# EAGLE design Drone (EAGLE 9.6.2)
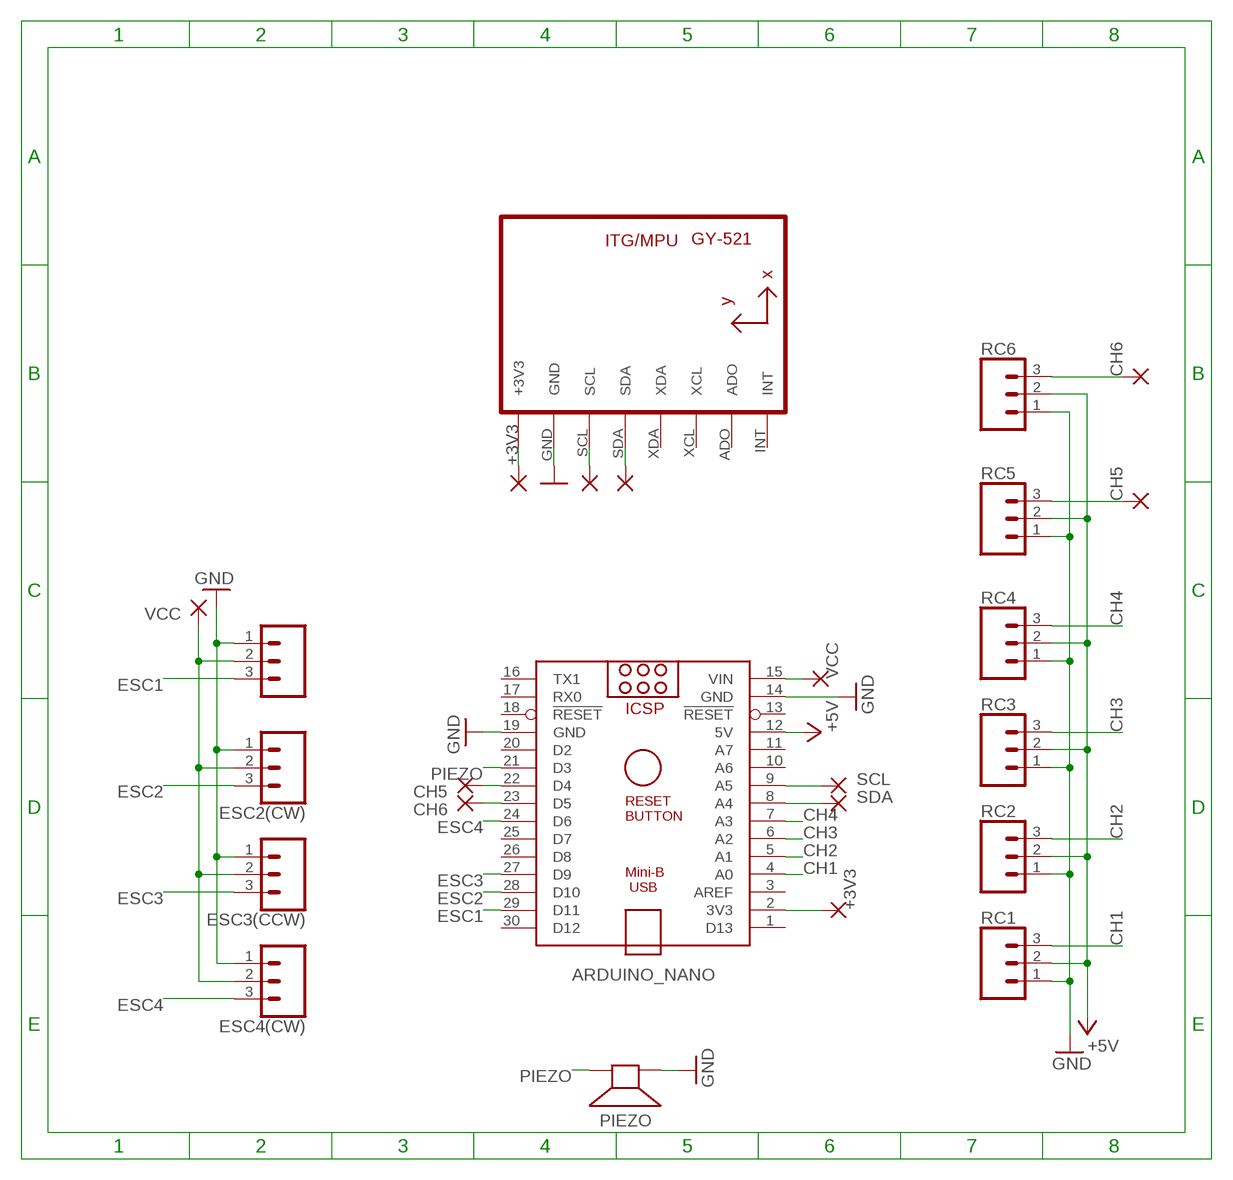
[diagram p0: schematic, sheet 1]

## Parts
+3V3-1  +3V3  WIREPAD1,6/0,8  [1,6/0,8]
+3V3-2  +3V3  WIREPAD1,6/0,8  [1,6/0,8]
ARDUINO_NANO  ARDUINO_NANO  [ARDUINO_NANO]
CH5  SCL  WIREPAD1,6/0,8  [1,6/0,8]
CH5-2  SCL  WIREPAD1,6/0,8  [1,6/0,8]
CH6  SCL  WIREPAD1,6/0,8  [1,6/0,8]
CH6-2  SCL  WIREPAD1,6/0,8  [1,6/0,8]
ECS1(CCW)  CONN_03  [1X03]
ESC2(CW)  CONN_03  [1X03]
ESC3(CCW)  CONN_03  [1X03]
ESC4(CW)  CONN_03  [1X03]
PIEZO  SPEAKER/AL60P  [AL60P]
RC1  CONN_03  [1X03]
RC2  CONN_03  [1X03]
RC3  CONN_03  [1X03]
RC4  CONN_03  [1X03]
RC5  CONN_03  [1X03]
RC6  CONN_03  [1X03]
SCL  SCL  WIREPAD1,6/0,8  [1,6/0,8]
SCL-2  SCL  WIREPAD1,6/0,8  [1,6/0,8]
SDA  SDA  WIREPAD1,6/0,8  [1,6/0,8]
SDA-2  SDA  WIREPAD1,6/0,8  [1,6/0,8]
U1  GY-521MPU6050  [GY-521]
VCC-1  VCC  WIREPAD1,6/0,8  [1,6/0,8]
VCC-2  VCC  WIREPAD1,6/0,8  [1,6/0,8]

## Nets
+3V3: +3V3-1.1(P) +3V3-2.1(P) ARDUINO_NANO.2(3V3) U1.VCC(+3V3)
+5V: ARDUINO_NANO.12(5V) RC1.2 RC2.2 RC3.2 RC4.2 RC5.2 RC6.2
CH1: ARDUINO_NANO.4(A0) RC1.3
CH2: ARDUINO_NANO.5(A1) RC2.3
CH3: ARDUINO_NANO.6(A2) RC3.3
CH4: ARDUINO_NANO.7(A3) RC4.3
CH5: ARDUINO_NANO.22(D4) CH5-2.1(P) CH5.1(P) RC5.3
CH6: ARDUINO_NANO.23(D5) CH6-2.1(P) CH6.1(P) RC6.3
ESC1: ARDUINO_NANO.29(D11) ECS1(CCW).3
ESC2: ARDUINO_NANO.28(D10) ESC2(CW).3
ESC3: ARDUINO_NANO.27(D9) ESC3(CCW).3
ESC4: ARDUINO_NANO.24(D6) ESC4(CW).3
GND: ARDUINO_NANO.14(GND) ARDUINO_NANO.19(GND) ECS1(CCW).1 ESC2(CW).1 ESC3(CCW).1 ESC4(CW).1 PIEZO.1(+) RC1.1 RC2.1 RC3.1 RC4.1 RC5.1 RC6.1 U1.GND
PIEZO: ARDUINO_NANO.21(D3) PIEZO.2(-)
SCL: ARDUINO_NANO.9(A5) SCL-2.1(P) SCL.1(P) U1.SCL
SDA: ARDUINO_NANO.8(A4) SDA-2.1(P) SDA.1(P) U1.SDA
VCC: ARDUINO_NANO.15(VIN) ECS1(CCW).2 ESC2(CW).2 ESC3(CCW).2 ESC4(CW).2 VCC-1.1(P) VCC-2.1(P)
Unconnected: ARDUINO_NANO.1(D13) ARDUINO_NANO.3(AREF) ARDUINO_NANO.10(A6) ARDUINO_NANO.11(A7) ARDUINO_NANO.13(!RESET) ARDUINO_NANO.16(TX1) ARDUINO_NANO.17(RX0) ARDUINO_NANO.18(!RESET) ARDUINO_NANO.20(D2) ARDUINO_NANO.25(D7) ARDUINO_NANO.26(D8) ARDUINO_NANO.30(D12) U1.ADO U1.INT U1.XCL U1.XDA

## Library data of the parts
+3V3-1 +3V3-2 CH5 CH5-2 CH6 CH6-2 SCL SCL-2 SDA SDA-2 VCC-1 VCC-2 = wirepad:WIREPAD: Wire PAD connect wire on PCB
ARDUINO_NANO = ArduinoNanoV30:ARDUINO_NANO: Arduino Nano V3.0 Overview: The Arduino Nano is a small, complete, and breadboard-friendly board based on the ATmega328 (Arduino Nano 3.x) or ATmega168 (Arduino Nano 2.x). It has more or less the same functionality of the Arduino Duemilanove, but in a different package. It lacks only a DC power jack, and works with a Mini-B USB cable instead of a standard one. The Nano was designed and is being produced by Gravitech. Specifications: Microcontroller Atmel ATmega168 or ATmega328 Operating Voltage (logic level) 5 V Input Voltage (recommended) 7-12 V Input Voltage (limits) 6-20 V Digital I/O Pins 14 (of which 6 provide PWM output) Analog Input Pins 8 DC Current per I/O Pin 40 mA Flash Memory 16 KB (ATmega168) or 32 KB (ATmega328) of which 2 KB used by bootloader SRAM 1 KB (ATmega168) or 2 KB (ATmega328) EEPROM 512 bytes (ATmega168) or 1 KB (ATmega328) Clock Speed 16 MHz Dimensions 0.73" x 1.70" Length 45 mm Width 18 mm Weigth 5 g Power: The Arduino Nano can be powered via the Mini-B USB connection, 6-20V unregulated external power supply (pin 30), or 5V regulated external power supply (pin 27). The power source is automatically selected to the highest voltage source. Memory: The ATmega168 has 16 KB of flash memory for storing code (of which 2 KB is used for the bootloader); the ATmega328 has 32 KB, (also with 2 KB used for the bootloader). The ATmega168 has 1 KB of SRAM and 512 bytes of EEPROM (which can be read and written with the EEPROM library); the ATmega328 has 2 KB of SRAM and 1 KB of EEPROM. Input and Output: Each of the 14 digital pins on the Nano can be used as an input or output, using pinMode(), digitalWrite(), and digitalRead() functions. They operate at 5 volts. Each pin can provide or receive a maximum of 40 mA and has an internal pull-up resistor (disconnected by default) of 20-50 kOhms. In addition, some pins have specialized functions. Visit Arduino - ArduinoBoardNano <https://www.arduino.cc/en/Main/ArduinoBoardNano>
ECS1(CCW) ESC2(CW) ESC3(CCW) ESC4(CW) RC1-RC6 = SparkFun-Connectors:CONN_03: Multi connection point. Often used as Generic Header-pin footprint for 0.1 inch spaced/style header connections On any of the 0.1 inch spaced packages, you can populate with these: Break Away Headers - Straight <https://www.sparkfun.com/products/116> (PRT-00116) Break Away Male Headers - Right Angle <https://www.sparkfun.com/products/553> (PRT-00553) Female Headers <https://www.sparkfun.com/products/115> (PRT-00115) Break Away Headers - Machine Pin <https://www.sparkfun.com/products/117> (PRT-00117) Break Away Female Headers - Swiss Machine Pin <https://www.sparkfun.com/products/743> (PRT-00743) Stackable Header - 3 Pin (Female, 0.1") <https://www.sparkfun.com/products/13875> (PRT-13875) For SCREWTERMINALS and SPRING TERMINALS visit here: Screw Terimnals on SparkFun.com <https://www.sparkfun.com/search/results?term=Screw+Terminals> (5mm/3.5mm/2.54mm spacing) This device is also useful as a general connection point to wire up your design to another part of your project. Our various solder wires solder well into these plated through hole pads. Hook-Up Wire - Assortment (Stranded, 22 AWG) <https://www.sparkfun.com/products/11375> (PRT-11375) Hook-Up Wire - Assortment (Solid Core, 22 AWG) <https://www.sparkfun.com/products/11367> (PRT-11367) View the entire wire category on our website here <https://www.sparkfun.com/categories/141> Special notes: Molex polarized connector foot print use with SKU : PRT-08232 with associated crimp pins and housings.
PIEZO = adafruit:SPEAKER: SPEAKER Source: Buerklin Added PS12 (for part # PS1240 piezo) http://www.ladyada.net/library/pcb/eaglelibrary.html
U1 = gy-521:GY-521

## Board
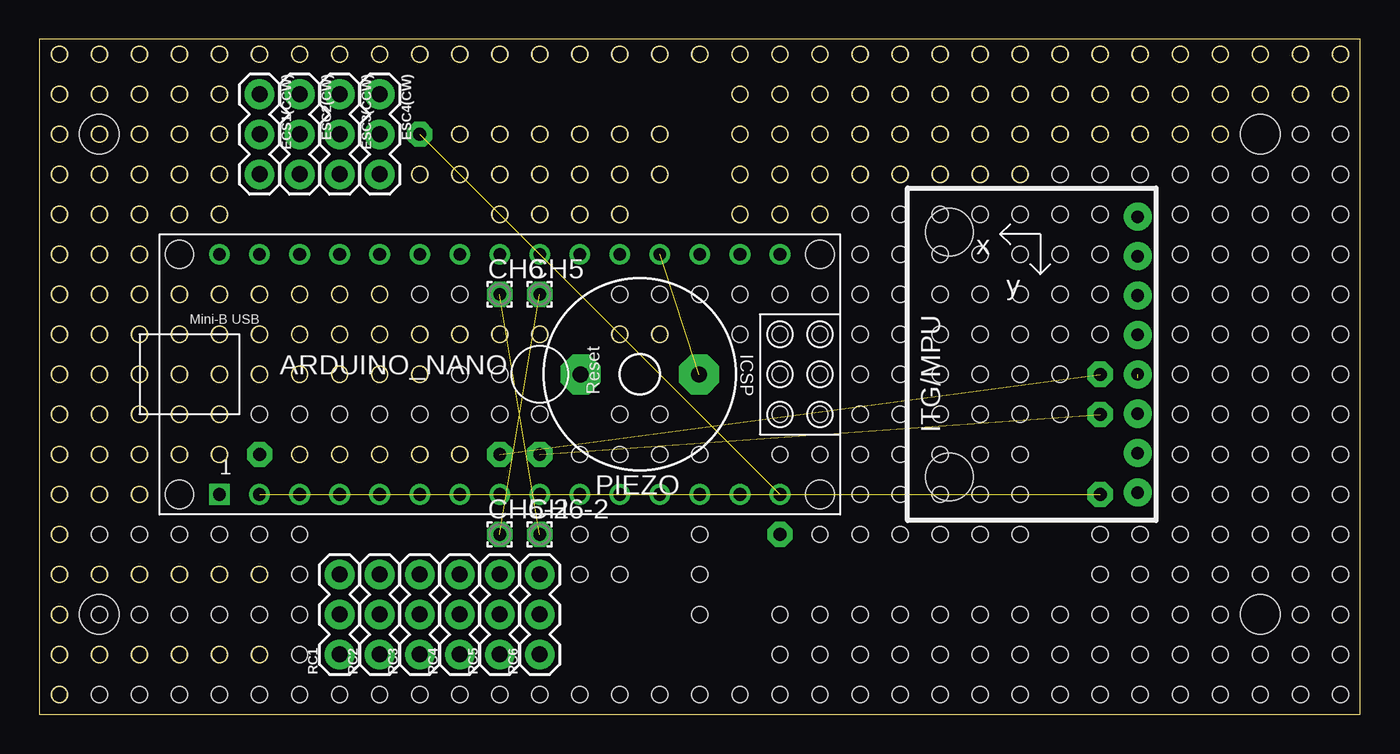
[diagram p1: board, top side]
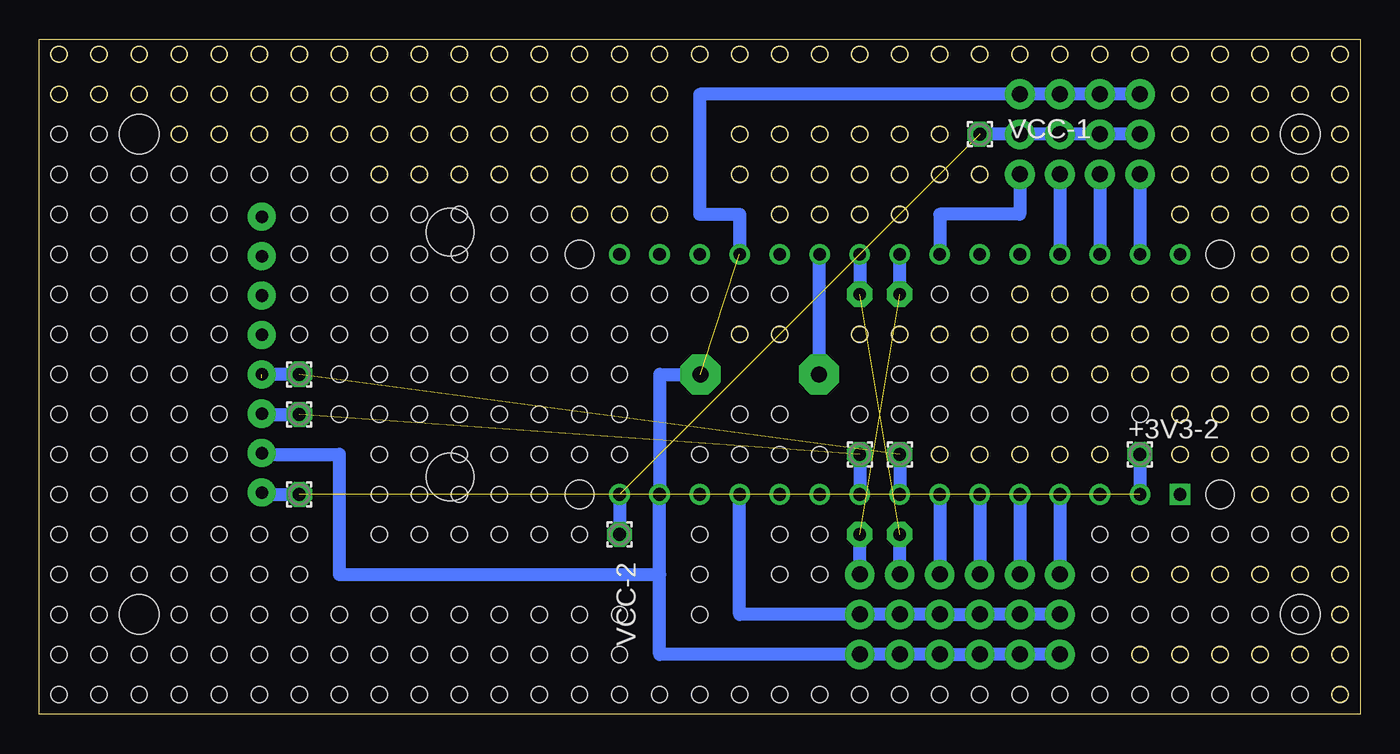
[diagram p2: board, bottom side, seen from below]

Size 83.8 x 42.85 mm. Coordinates in mm from the lower left corner, seen from the top.
Outline: 28.71,24.19 28.71,24.19
Outline: 29.71,24.07 arc180 28.71,24.19
Outline: 29.71,24.07 29.71,24.07
Outline: 29.71,24.07 arc-129 28.85,23.78 arc-43 28.71,24.13 arc-7 28.71,24.19
Outline: 9.39,3.75 arc180 8.39,3.87 8.39,3.87 arc7 8.39,3.81 arc133 9.24,3.45 arc39 9.39,3.75
Outline: 9.39,3.75 9.39,3.75
Outline: 4.31,24.19 4.31,24.19
Outline: 3.31,24.07 arc180 4.31,24.19
Outline: 3.31,24.07 3.31,24.07
Outline: 3.31,24.07 arc-10 3.31,24.16 arc-170 4.31,24.19
Outline: 9.39,26.73 9.39,26.73
Outline: 8.39,26.61 arc180 9.39,26.73
Outline: 8.39,26.61 8.39,26.61
Outline: 8.39,26.61 arc-10 8.39,26.7 arc-170 9.39,26.73
Outline: 14.47,8.95 14.47,8.95
Outline: 13.47,8.83 arc180 14.47,8.95
Outline: 13.47,8.83 13.47,8.83
Outline: 13.47,8.83 arc-10 13.47,8.92 arc-170 14.47,8.95
Outline: 18.55,41.85 arc180 19.55,41.97 19.55,41.97 arc170 18.55,41.94 arc10 18.55,41.85
Outline: 18.55,41.85 18.55,41.85
Outline: 23.63,24.19 23.63,24.19
Outline: 24.63,24.07 arc180 23.63,24.19
Outline: 24.63,24.07 24.63,24.07
Outline: 24.63,24.07 arc-129 23.77,23.78 arc-43 23.63,24.13 arc-7 23.63,24.19
Outline: 18.55,21.53 arc180 19.55,21.65 19.55,21.65 arc170 18.55,21.62 arc10 18.55,21.53
Outline: 18.55,21.53 18.55,21.53
Outline: 3.31,3.75 arc180 4.31,3.87 4.31,3.87 arc170 3.31,3.84 arc10 3.31,3.75
Outline: 3.31,3.75 3.31,3.75
Outline: 39.87,41.85 arc180 38.87,41.97 38.87,41.97 arc7 38.87,41.91 arc133 39.72,41.55 arc39 39.87,41.85
Outline: 39.87,41.85 39.87,41.85
Outline: 19.55,26.73 19.55,26.73
Outline: 18.55,26.61 arc180 19.55,26.73
Outline: 18.55,26.61 18.55,26.61
Outline: 18.55,26.61 arc-10 18.55,26.7 arc-170 19.55,26.73
Outline: 14.47,24.19 14.47,24.19
Outline: 13.47,24.07 arc180 14.47,24.19
Outline: 13.47,24.07 13.47,24.07
Outline: 13.47,24.07 arc-10 13.47,24.16 arc-170 14.47,24.19
Outline: 8.39,21.53 arc180 9.39,21.65 9.39,21.65 arc170 8.39,21.62 arc10 8.39,21.53
Outline: 8.39,21.53 8.39,21.53
Outline: 9.39,41.85 arc180 8.39,41.97 8.39,41.97 arc7 8.39,41.91 arc43 8.53,41.56 arc129 9.39,41.85
Outline: 9.39,41.85 9.39,41.85
Outline: 4.31,8.95 4.31,8.95
Outline: 3.31,8.83 arc180 4.31,8.95
Outline: 3.31,8.83 3.31,8.83
Outline: 3.31,8.83 arc-10 3.31,8.92 arc-170 4.31,8.95
Outline: 9.39,31.81 9.39,31.81
Outline: 9.39,31.81 arc-180 8.39,31.69 8.39,31.69 arc-10 8.39,31.78 arc-170 9.39,31.81
Outline: 29.71,31.81 29.71,31.81
Outline: 29.71,31.81 arc-180 28.71,31.69 28.71,31.69 arc-10 28.71,31.78 arc-170 29.71,31.81
Outline: 13.47,3.75 arc180 14.47,3.87 14.47,3.87 arc170 13.47,3.84 arc10 13.47,3.75
Outline: 13.47,3.75 13.47,3.75
Outline: 28.71,41.85 arc180 29.71,41.97 29.71,41.97 arc170 28.71,41.94 arc10 28.71,41.85
Outline: 28.71,41.85 28.71,41.85
Outline: 4.31,29.27 4.31,29.27
Outline: 3.31,29.15 arc180 4.31,29.27
Outline: 3.31,29.15 3.31,29.15
Outline: 3.31,29.15 arc-10 3.31,29.24 arc-170 4.31,29.27
Outline: 1.77,39.43 1.77,39.43
Outline: 1.77,39.43 arc-180 0.77,39.31 0.77,39.31 arc-10 0.77,39.4 arc-170 1.77,39.43
Outline: 3.31,39.43 3.31,39.43
Outline: 3.31,39.43 arc-180 4.31,39.31 4.31,39.31 arc-129 3.45,39.02 arc-43 3.31,39.37 arc-7 3.31,39.43
Outline: 32.25,24.19 32.25,24.19
Outline: 31.25,24.07 arc180 32.25,24.19
Outline: 31.25,24.07 31.25,24.07
Outline: 31.25,24.07 arc-10 31.25,24.16 arc-170 32.25,24.19
Outline: 17.01,26.73 17.01,26.73
Outline: 16.01,26.61 arc180 17.01,26.73
Outline: 16.01,26.61 16.01,26.61
Outline: 16.01,26.61 arc-10 16.01,26.7 arc-170 17.01,26.73
Outline: 5.85,41.85 arc180 6.85,41.97 6.85,41.97 arc170 5.85,41.94 arc10 5.85,41.85
Outline: 5.85,41.85 5.85,41.85
Outline: 9.39,24.19 9.39,24.19
Outline: 8.39,24.07 arc180 9.39,24.19
Outline: 8.39,24.07 8.39,24.07
Outline: 8.39,24.07 arc-10 8.39,24.16 arc-170 9.39,24.19
Outline: 4.31,26.73 4.31,26.73
Outline: 3.31,26.61 arc180 4.31,26.73
Outline: 3.31,26.61 3.31,26.61
Outline: 3.31,26.61 arc-10 3.31,26.7 arc-170 4.31,26.73
Outline: 33.79,41.85 arc180 34.79,41.97 34.79,41.97 arc170 33.79,41.94 arc10 33.79,41.85
Outline: 33.79,41.85 33.79,41.85
Outline: 34.79,31.81 34.79,31.81
Outline: 34.79,31.81 arc-180 33.79,31.69 33.79,31.69 arc-10 33.79,31.78 arc-170 34.79,31.81
Outline: 13.47,41.85 arc180 14.47,41.97 14.47,41.97 arc170 13.47,41.94 arc10 13.47,41.85
Outline: 13.47,41.85 13.47,41.85
Outline: 14.47,21.53 arc180 13.47,21.65 13.47,21.65 arc7 13.47,21.59 arc133 14.32,21.23 arc39 14.47,21.53
Outline: 14.47,21.53 14.47,21.53
Outline: 24.63,21.53 arc180 23.63,21.65 23.63,21.65 arc7 23.63,21.59 arc43 23.77,21.24 arc129 24.63,21.53
Outline: 24.63,21.53 24.63,21.53
Outline: 23.63,41.85 arc180 24.63,41.97 24.63,41.97 arc170 23.63,41.94 arc10 23.63,41.85
Outline: 23.63,41.85 23.63,41.85
Outline: 13.47,26.73 13.47,26.73
Outline: 14.47,26.61 arc180 13.47,26.73
Outline: 14.47,26.61 14.47,26.61
Outline: 14.47,26.61 arc-39 14.32,26.31 arc-133 13.47,26.67 arc-7 13.47,26.73
Outline: 9.39,39.43 9.39,39.43
Outline: 9.39,39.43 arc-180 8.39,39.31 8.39,39.31 arc-10 8.39,39.4 arc-170 9.39,39.43
Outline: 19.55,24.19 19.55,24.19
Outline: 18.55,24.07 arc180 19.55,24.19
Outline: 18.55,24.07 18.55,24.07
Outline: 18.55,24.07 arc-10 18.55,24.16 arc-170 19.55,24.19
Outline: 6.85,3.75 arc180 5.85,3.87 5.85,3.87 arc7 5.85,3.81 arc133 6.7,3.45 arc39 6.85,3.75
Outline: 6.85,3.75 6.85,3.75
Outline: 21.09,26.73 21.09,26.73
Outline: 22.09,26.61 arc180 21.09,26.73
Outline: 22.09,26.61 22.09,26.61
Outline: 22.09,26.61 arc-39 21.94,26.31 arc-133 21.09,26.67 arc-7 21.09,26.73
Outline: 32.25,41.85 arc180 31.25,41.97 31.25,41.97 arc7 31.25,41.91 arc133 32.1,41.55 arc39 32.25,41.85
Outline: 32.25,41.85 32.25,41.85
Outline: 31.25,31.81 31.25,31.81
Outline: 31.25,31.81 arc-180 32.25,31.69 32.25,31.69 arc-129 31.39,31.4 arc-43 31.25,31.75 arc-7 31.25,31.81
Outline: 11.93,41.85 arc180 10.93,41.97 10.93,41.97 arc7 10.93,41.91 arc133 11.78,41.55 arc39 11.93,41.85
Outline: 11.93,41.85 11.93,41.85
Outline: 10.93,31.81 10.93,31.81
Outline: 10.93,31.81 arc-180 11.93,31.69 11.93,31.69 arc-39 11.78,31.39 arc-133 10.93,31.75 arc-7 10.93,31.81
Outline: 11.93,21.53 arc180 10.93,21.65 10.93,21.65 arc7 10.93,21.59 arc133 11.78,21.23 arc39 11.93,21.53
Outline: 11.93,21.53 11.93,21.53
Outline: 0.77,26.73 0.77,26.73
Outline: 1.77,26.61 arc180 0.77,26.73
Outline: 1.77,26.61 1.77,26.61
Outline: 1.77,26.61 arc-129 0.91,26.32 arc-43 0.77,26.67 arc-7 0.77,26.73
Outline: 5.85,39.43 5.85,39.43
Outline: 5.85,39.43 arc-180 6.85,39.31 6.85,39.31 arc-129 5.99,39.02 arc-43 5.85,39.37 arc-7 5.85,39.43
Outline: 22.09,41.85 arc180 21.09,41.97 21.09,41.97 arc7 21.09,41.91 arc133 21.94,41.55 arc39 22.09,41.85
Outline: 22.09,41.85 22.09,41.85
Outline: 0.77,1.33 0.77,1.33
Outline: 1.77,1.21 arc180 0.77,1.33
Outline: 1.77,1.21 1.77,1.21
Outline: 1.77,1.21 arc-39 1.62,0.91 arc-133 0.77,1.27 arc-7 0.77,1.33
Outline: 22.09,21.53 arc180 21.09,21.65 21.09,21.65 arc7 21.09,21.59 arc43 21.23,21.24 arc129 22.09,21.53
Outline: 22.09,21.53 22.09,21.53
Outline: 0.77,11.49 0.77,11.49
Outline: 0.77,11.49 arc-180 1.77,11.37 1.77,11.37 arc-39 1.62,11.07 arc-133 0.77,11.43 arc-7 0.77,11.49
Outline: 1.77,21.53 arc180 0.77,21.65 0.77,21.65 arc7 0.77,21.59 arc133 1.62,21.23 arc39 1.77,21.53
Outline: 1.77,21.53 1.77,21.53
Outline: 1.77,41.85 arc180 0.77,41.97 0.77,41.97 arc7 0.77,41.91 arc43 0.91,41.56 arc129 1.77,41.85
Outline: 1.77,41.85 1.77,41.85
Outline: 0.77,31.81 0.77,31.81
Outline: 0.77,31.81 arc-180 1.77,31.69 1.77,31.69 arc-129 0.91,31.4 arc-43 0.77,31.75 arc-7 0.77,31.81
Outline: 36.33,24.19 36.33,24.19
Outline: 37.33,24.07 arc180 36.33,24.19
Outline: 37.33,24.07 37.33,24.07
Outline: 37.33,24.07 arc-129 36.47,23.78 arc-43 36.33,24.13 arc-7 36.33,24.19
Outline: 16.01,24.19 16.01,24.19
Outline: 17.01,24.07 arc180 16.01,24.19
Outline: 17.01,24.07 17.01,24.07
Outline: 17.01,24.07 arc-39 16.86,23.77 arc-133 16.01,24.13 arc-7 16.01,24.19
Outline: 10.93,26.73 10.93,26.73
Outline: 11.93,26.61 arc180 10.93,26.73
Outline: 11.93,26.61 11.93,26.61
Outline: 11.93,26.61 arc-39 11.78,26.31 arc-133 10.93,26.67 arc-7 10.93,26.73
Outline: 5.85,29.27 5.85,29.27
Outline: 6.85,29.15 arc180 5.85,29.27
Outline: 6.85,29.15 6.85,29.15
Outline: 6.85,29.15 arc-129 5.99,28.86 arc-43 5.85,29.21 arc-7 5.85,29.27
Outline: 0.77,8.95 0.77,8.95
Outline: 1.77,8.83 arc180 0.77,8.95
Outline: 1.77,8.83 1.77,8.83
Outline: 1.77,8.83 arc-39 1.62,8.53 arc-133 0.77,8.89 arc-7 0.77,8.95
Outline: 5.85,31.81 5.85,31.81
Outline: 5.85,31.81 arc-180 6.85,31.69 6.85,31.69 arc-129 5.99,31.4 arc-43 5.85,31.75 arc-7 5.85,31.81
Outline: 26.17,41.85 arc180 27.17,41.97 27.17,41.97 arc170 26.17,41.94 arc10 26.17,41.85
Outline: 26.17,41.85 26.17,41.85
Outline: 5.85,21.53 arc180 6.85,21.65 6.85,21.65 arc170 5.85,21.62 arc10 5.85,21.53
Outline: 5.85,21.53 5.85,21.53
Outline: 11.93,24.19 11.93,24.19
Outline: 10.93,24.07 arc180 11.93,24.19
Outline: 10.93,24.07 10.93,24.07
Outline: 10.93,24.07 arc-10 10.93,24.16 arc-170 11.93,24.19
Outline: 1.77,29.27 1.77,29.27
Outline: 0.77,29.15 arc180 1.77,29.27
Outline: 0.77,29.15 0.77,29.15
Outline: 0.77,29.15 arc-10 0.77,29.24 arc-170 1.77,29.27
Outline: 16.01,41.85 arc180 17.01,41.97 17.01,41.97 arc170 16.01,41.94 arc10 16.01,41.85
Outline: 16.01,41.85 16.01,41.85
Outline: 37.33,31.81 37.33,31.81
Outline: 37.33,31.81 arc-180 36.33,31.69 36.33,31.69 arc-10 36.33,31.78 arc-170 37.33,31.81
Outline: 22.09,24.19 22.09,24.19
Outline: 21.09,24.07 arc180 22.09,24.19
Outline: 21.09,24.07 21.09,24.07
Outline: 21.09,24.07 arc-10 21.09,24.16 arc-170 22.09,24.19
Outline: 0.77,3.75 arc180 1.77,3.87 1.77,3.87 arc170 0.77,3.84 arc10 0.77,3.75
Outline: 0.77,3.75 0.77,3.75
Outline: 1.77,24.19 1.77,24.19
Outline: 0.77,24.07 arc180 1.77,24.19
Outline: 0.77,24.07 0.77,24.07
Outline: 0.77,24.07 arc-10 0.77,24.16 arc-170 1.77,24.19
Outline: 11.93,8.95 11.93,8.95
Outline: 10.93,8.83 arc180 11.93,8.95
Outline: 10.93,8.83 10.93,8.83
Outline: 10.93,8.83 arc-10 10.93,8.92 arc-170 11.93,8.95
Outline: 16.01,21.53 arc180 17.01,21.65 17.01,21.65 arc170 16.01,21.62 arc10 16.01,21.53
Outline: 16.01,21.53 16.01,21.53
Outline: 11.93,3.75 arc180 10.93,3.87 10.93,3.87 arc7 10.93,3.81 arc133 11.78,3.45 arc39 11.93,3.75
Outline: 11.93,3.75 11.93,3.75
Outline: 6.85,8.95 6.85,8.95
Outline: 5.85,8.83 arc180 6.85,8.95
Outline: 5.85,8.83 5.85,8.83
Outline: 5.85,8.83 arc-10 5.85,8.92 arc-170 6.85,8.95
Outline: 5.85,24.19 5.85,24.19
Outline: 6.85,24.07 arc180 5.85,24.19
Outline: 6.85,24.07 6.85,24.07
Outline: 6.85,24.07 arc-39 6.7,23.77 arc-133 5.85,24.13 arc-7 5.85,24.19
Outline: 26.17,24.19 26.17,24.19
Outline: 27.17,24.07 arc180 26.17,24.19
Outline: 27.17,24.07 27.17,24.07
Outline: 27.17,24.07 arc-129 26.31,23.78 arc-43 26.17,24.13 arc-7 26.17,24.19
Outline: 5.85,26.73 5.85,26.73
Outline: 6.85,26.61 arc180 5.85,26.73
Outline: 6.85,26.61 6.85,26.61
Outline: 6.85,26.61 arc-129 5.99,26.32 arc-43 5.85,26.67 arc-7 5.85,26.73
Outline: 10.93,39.43 10.93,39.43
Outline: 10.93,39.43 arc-180 11.93,39.31 11.93,39.31 arc-39 11.78,39.01 arc-133 10.93,39.37 arc-7 10.93,39.43
Outline: 37.33,41.85 arc180 36.33,41.97 36.33,41.97 arc7 36.33,41.91 arc133 37.18,41.55 arc39 37.33,41.85
Outline: 37.33,41.85 37.33,41.85
Outline: 4.31,31.81 4.31,31.81
Outline: 4.31,31.81 arc-180 3.31,31.69 3.31,31.69 arc-10 3.31,31.78 arc-170 4.31,31.81
Outline: 38.87,24.19 38.87,24.19
Outline: 39.87,24.07 arc180 38.87,24.19
Outline: 39.87,24.07 39.87,24.07
Outline: 39.87,24.07 arc-129 39.01,23.78 arc-43 38.87,24.13 arc-7 38.87,24.19
Outline: 3.31,21.53 arc180 4.31,21.65 4.31,21.65 arc170 3.31,21.62 arc10 3.31,21.53
Outline: 3.31,21.53 3.31,21.53
Outline: 3.31,41.85 arc180 4.31,41.97 4.31,41.97 arc170 3.31,41.94 arc10 3.31,41.85
Outline: 3.31,41.85 3.31,41.85
Outline: 9.39,8.95 9.39,8.95
Outline: 8.39,8.83 arc180 9.39,8.95
Outline: 8.39,8.83 8.39,8.83
Outline: 8.39,8.83 arc-10 8.39,8.92 arc-170 9.39,8.95
Outline: 4.31,34.35 4.31,34.35 arc-180 3.31,34.23 3.31,34.23 arc-10 3.31,34.32 arc-170 4.31,34.35
Outline: 9.39,36.89 9.39,36.89 arc-180 8.39,36.77 8.39,36.77 arc-10 8.39,36.86 arc-170 9.39,36.89
Outline: 9.39,16.57 9.39,16.57 arc-180 8.39,16.45 8.39,16.45 arc-10 8.39,16.54 arc-170 9.39,16.57
Outline: 23.63,34.35 23.63,34.35 arc-180 24.63,34.23 24.63,34.23 arc-129 23.77,33.94 arc-43 23.63,34.29 arc-7 23.63,34.35
Outline: 29.71,36.89 29.71,36.89 arc-180 28.71,36.77 28.71,36.77 arc-10 28.71,36.86 arc-170 29.71,36.89
Outline: 4.31,14.03 4.31,14.03 arc-180 3.31,13.91 3.31,13.91 arc-10 3.31,14 arc-170 4.31,14.03
Outline: 3.31,19.11 3.31,19.11 arc-180 4.31,18.99 4.31,18.99 arc-39 4.16,18.69 arc-133 3.31,19.05 arc-7 3.31,19.11
Outline: 34.79,34.35 34.79,34.35 arc-180 33.79,34.23 33.79,34.23 arc-10 33.79,34.32 arc-170 34.79,34.35
Outline: 39.87,36.89 39.87,36.89 arc-180 38.87,36.77 38.87,36.77 arc-10 38.87,36.86 arc-170 39.87,36.89
Outline: 19.55,16.57 19.55,16.57 arc-180 18.55,16.45 18.55,16.45 arc-10 18.55,16.54 arc-170 19.55,16.57
Outline: 29.71,34.35 29.71,34.35 arc-180 28.71,34.23 28.71,34.23 arc-10 28.71,34.32 arc-170 29.71,34.35
Outline: 4.31,36.89 4.31,36.89 arc-180 3.31,36.77 3.31,36.77 arc-10 3.31,36.86 arc-170 4.31,36.89
Outline: 24.63,16.57 24.63,16.57 arc-180 23.63,16.45 23.63,16.45 arc-10 23.63,16.54 arc-170 24.63,16.57
Outline: 4.31,16.57 4.31,16.57 arc-180 3.31,16.45 3.31,16.45 arc-10 3.31,16.54 arc-170 4.31,16.57
Outline: 9.39,34.35 9.39,34.35 arc-180 8.39,34.23 8.39,34.23 arc-10 8.39,34.32 arc-170 9.39,34.35
Outline: 34.79,36.89 34.79,36.89 arc-180 33.79,36.77 33.79,36.77 arc-10 33.79,36.86 arc-170 34.79,36.89
Outline: 39.87,34.35 39.87,34.35 arc-180 38.87,34.23 38.87,34.23 arc-10 38.87,34.32 arc-170 39.87,34.35
Outline: 79.51,39.34 79.51,39.4 arc-180 80.51,39.34 arc-174 79.51,39.34
Outline: 64.27,41.88 64.27,41.94 arc-180 65.27,41.88 arc-174 64.27,41.88
Outline: 46.49,39.34 46.49,39.4 arc-180 47.49,39.34 arc-174 46.49,39.34
Outline: 56.65,34.26 56.65,34.32 arc-180 57.65,34.26 arc-174 56.65,34.26
Outline: 51.57,34.26 51.57,34.32 arc-180 52.57,34.26 arc-174 51.57,34.26
Outline: 46.49,41.88 46.49,41.94 arc-180 47.49,41.88 arc-174 46.49,41.88
Outline: 66.81,41.88 66.81,41.94 arc-180 67.81,41.88 arc-174 66.81,41.88
Outline: 66.81,39.34 66.81,39.4 arc-180 67.81,39.34 arc-174 66.81,39.34
Outline: 71.89,41.88 71.89,41.94 arc-180 72.89,41.88 arc-174 71.89,41.88
Outline: 61.73,39.34 61.73,39.4 arc-180 62.73,39.34 arc-174 61.73,39.34
Outline: 56.65,36.8 56.65,36.86 arc-180 57.65,36.8 arc-174 56.65,36.8
Outline: 61.73,36.8 61.73,36.86 arc-180 62.73,36.8 arc-174 61.73,36.8
Outline: 51.57,41.88 51.57,41.94 arc-180 52.57,41.88 arc-174 51.57,41.88
Outline: 0.77,6.41 0.77,6.41 arc-180 1.77,6.29 1.77,6.29 arc-39 1.62,5.99 arc-133 0.77,6.35 arc-7 0.77,6.41
Outline: 21.09,16.57 21.09,16.57 arc-180 22.09,16.45 22.09,16.45 arc-39 21.94,16.15 arc-133 21.09,16.51 arc-7 21.09,16.57
Outline: 10.93,36.89 10.93,36.89 arc-180 11.93,36.77 11.93,36.77 arc-129 11.07,36.48 arc-43 10.93,36.83 arc-7 10.93,36.89
Outline: 31.25,36.89 31.25,36.89 arc-180 32.25,36.77 32.25,36.77 arc-129 31.39,36.48 arc-43 31.25,36.83 arc-7 31.25,36.89
Outline: 10.93,16.57 10.93,16.57 arc-180 11.93,16.45 11.93,16.45 arc-129 11.07,16.16 arc-43 10.93,16.51 arc-7 10.93,16.57
Outline: 5.85,19.11 5.85,19.11 arc-180 6.85,18.99 6.85,18.99 arc-129 5.99,18.7 arc-43 5.85,19.05 arc-7 5.85,19.11
Outline: 0.77,19.11 0.77,19.11 arc-180 1.77,18.99 1.77,18.99 arc-39 1.62,18.69 arc-133 0.77,19.05 arc-7 0.77,19.11
Outline: 31.25,34.35 31.25,34.35 arc-180 32.25,34.23 32.25,34.23 arc-129 31.39,33.94 arc-43 31.25,34.29 arc-7 31.25,34.35
Outline: 16.01,16.57 16.01,16.57 arc-180 17.01,16.45 17.01,16.45 arc-129 16.15,16.16 arc-43 16.01,16.51 arc-7 16.01,16.57
Outline: 10.93,34.35 10.93,34.35 arc-180 11.93,34.23 11.93,34.23 arc-129 11.07,33.94 arc-43 10.93,34.29 arc-7 10.93,34.35
Outline: 37.33,36.89 37.33,36.89 arc-180 36.33,36.77 36.33,36.77 arc-10 36.33,36.86 arc-170 37.33,36.89
Outline: 6.85,16.57 6.85,16.57 arc-180 5.85,16.45 5.85,16.45 arc-10 5.85,16.54 arc-170 6.85,16.57
Outline: 27.17,36.89 27.17,36.89 arc-180 26.17,36.77 26.17,36.77 arc-10 26.17,36.86 arc-170 27.17,36.89
Outline: 27.17,16.57 27.17,16.57 arc-180 26.17,16.45 26.17,16.45 arc-10 26.17,16.54 arc-170 27.17,16.57
Outline: 1.77,14.03 1.77,14.03 arc-180 0.77,13.91 0.77,13.91 arc-10 0.77,14 arc-170 1.77,14.03
Outline: 6.85,36.89 6.85,36.89 arc-180 5.85,36.77 5.85,36.77 arc-10 5.85,36.86 arc-170 6.85,36.89
Outline: 1.77,34.35 1.77,34.35 arc-180 0.77,34.23 0.77,34.23 arc-10 0.77,34.32 arc-170 1.77,34.35
Outline: 6.85,34.35 6.85,34.35 arc-180 5.85,34.23 5.85,34.23 arc-10 5.85,34.32 arc-170 6.85,34.35
Outline: 37.33,34.35 37.33,34.35 arc-180 36.33,34.23 36.33,34.23 arc-10 36.33,34.32 arc-170 37.33,34.35
Outline: 0.77,16.57 0.77,16.57 arc-180 1.77,16.45 1.77,16.45 arc-129 0.91,16.16 arc-43 0.77,16.51 arc-7 0.77,16.57
Outline: 0.77,36.89 0.77,36.89 arc-180 1.77,36.77 1.77,36.77 arc-129 0.91,36.48 arc-43 0.77,36.83 arc-7 0.77,36.89
Outline: 5.85,14.03 5.85,14.03 arc-180 6.85,13.91 6.85,13.91 arc-129 5.99,13.62 arc-43 5.85,13.97 arc-7 5.85,14.03
Outline: 26.17,34.35 26.17,34.35 arc-180 27.17,34.23 27.17,34.23 arc-39 27.02,33.93 arc-133 26.17,34.29 arc-7 26.17,34.35
Outline: 49.03,36.8 49.03,36.86 arc-180 50.03,36.8 arc-174 49.03,36.8
Outline: 82.05,39.34 82.05,39.4 arc-180 83.05,39.34 arc-174 82.05,39.34
Outline: 43.95,41.88 43.95,41.94 arc-180 44.95,41.88 arc-174 43.95,41.88
Outline: 49.03,34.26 49.03,34.32 arc-180 50.03,34.26 arc-174 49.03,34.26
Outline: 43.95,31.72 43.95,31.78 arc-180 44.95,31.72 arc-174 43.95,31.72
Outline: 74.43,36.8 74.43,36.86 arc-180 75.43,36.8 arc-174 74.43,36.8
Outline: 74.43,39.34 74.43,39.4 arc-180 75.43,39.34 arc-174 74.43,39.34
Outline: 46.49,31.72 46.49,31.78 arc-180 47.49,31.72 arc-174 46.49,31.72
Outline: 64.27,39.34 64.27,39.4 arc-180 65.27,39.34 arc-174 64.27,39.34
Outline: 64.27,36.8 64.27,36.86 arc-180 65.27,36.8 arc-174 64.27,36.8
Outline: 69.35,41.88 69.35,41.94 arc-180 70.35,41.88 arc-174 69.35,41.88
Outline: 69.35,39.34 69.35,39.4 arc-180 70.35,39.34 arc-174 69.35,39.34
Outline: 59.19,36.8 59.19,36.86 arc-180 60.19,36.8 arc-174 59.19,36.8
Outline: 54.11,41.88 54.11,41.94 arc-180 55.11,41.88 arc-174 54.11,41.88
Outline: 76.97,39.34 76.97,39.4 arc-180 77.97,39.34 arc-174 76.97,39.34
Outline: 46.49,34.26 46.49,34.32 arc-180 47.49,34.26 arc-174 46.49,34.26
Outline: 46.49,36.8 46.49,36.86 arc-180 47.49,36.8 arc-174 46.49,36.8
Outline: 61.73,34.26 61.73,34.32 arc-180 62.73,34.26 arc-174 61.73,34.26
Outline: 69.35,36.8 69.35,36.86 arc-180 70.35,36.8 arc-174 69.35,36.8
Outline: 59.19,41.88 59.19,41.94 arc-180 60.19,41.88 arc-174 59.19,41.88
Outline: 79.51,41.88 79.51,41.94 arc-180 80.51,41.88 arc-174 79.51,41.88
Outline: 59.19,39.34 59.19,39.4 arc-180 60.19,39.34 arc-174 59.19,39.34
Outline: 54.11,39.34 54.11,39.4 arc-180 55.11,39.34 arc-174 54.11,39.34
Outline: 54.11,36.8 54.11,36.86 arc-180 55.11,36.8 arc-174 54.11,36.8
Outline: 74.43,41.88 74.43,41.94 arc-180 75.43,41.88 arc-174 74.43,41.88
Outline: 61.73,41.88 61.73,41.94 arc-180 62.73,41.88 arc-174 61.73,41.88
Outline: 66.81,36.8 66.81,36.86 arc-180 67.81,36.8 arc-174 66.81,36.8
Outline: 71.89,39.34 71.89,39.4 arc-180 72.89,39.34 arc-174 71.89,39.34
Outline: 71.89,36.8 71.89,36.86 arc-180 72.89,36.8 arc-174 71.89,36.8
Outline: 56.65,41.88 56.65,41.94 arc-180 57.65,41.88 arc-174 56.65,41.88
Outline: 56.65,39.34 56.65,39.4 arc-180 57.65,39.34 arc-174 56.65,39.34
Outline: 51.57,39.34 51.57,39.4 arc-180 52.57,39.34 arc-174 51.57,39.34
Outline: 51.57,36.8 51.57,36.86 arc-180 52.57,36.8 arc-174 51.57,36.8
Outline: 76.97,41.88 76.97,41.94 arc-180 77.97,41.88 arc-174 76.97,41.88
Outline: 82.05,41.88 82.05,41.94 arc-180 83.05,41.88 arc-174 82.05,41.88
Outline: 49.03,41.88 49.03,41.94 arc-180 50.03,41.88 arc-174 49.03,41.88
Outline: 43.95,34.26 43.95,34.32 arc-180 44.95,34.26 arc-174 43.95,34.26
Outline: 10.93,19.11 10.93,19.11 arc-180 11.93,18.99 11.93,18.99 arc-39 11.78,18.69 arc-133 10.93,19.05 arc-7 10.93,19.11
Outline: 41.41,41.97 41.41,41.97 arc-11 41.43,42.06 arc-308 41.5,41.63 arc-41 41.41,41.97
Outline: 49.03,31.72 49.03,31.78 arc-180 50.03,31.72 arc-174 49.03,31.72
Outline: 9.39,19.11 9.39,19.11 arc-180 8.39,18.99 8.39,18.99 arc-10 8.39,19.08 arc-170 9.39,19.11
Outline: 59.19,34.26 59.19,34.32 arc-180 60.19,34.26 arc-174 59.19,34.26
Outline: 43.95,36.8 43.95,36.86 arc-180 44.95,36.8 arc-174 43.95,36.8
Outline: 49.03,39.34 49.03,39.4 arc-180 50.03,39.34 arc-174 49.03,39.34
Outline: 43.95,39.34 43.95,39.4 arc-180 44.95,39.34 arc-174 43.95,39.34
Outline: 54.11,34.26 54.11,34.32 arc-180 55.11,34.26 arc-174 54.11,34.26
Outline: 0,42.85 0,0 83.8,0 83.8,42.85 0,42.85
Copper layers (1*16): Top 0.035mm / dielectric 1.5mm / Bottom 0.035mm
Design rules "default": minimum track width 6mil, minimum drill 0.35mm, track to track 6mil, track to pad 6mil, pad to pad 6mil, via to via 6mil, smd to smd 6mil, copper to edge 40mil, drill to drill 6mil, minimum pad ring 10mil, minimum via ring 8mil, stop-mask expansion 4mil, vias tented up to drill 0mil, thermal gap 10mil
Holes 2.5 mm at 77.47,6.35 77.47,36.83 3.81,36.83 3.81,6.35
Holes 1.78 mm at 8.89,13.97 8.89,29.21 49.53,29.21 49.53,13.97 8.89,13.97 8.89,29.21 49.53,29.21 49.53,13.97 8.89,13.97 8.89,29.21 49.53,29.21 49.53,13.97 49.53,13.97 8.89,13.97 8.89,29.21 49.53,29.21 8.89,13.97 8.89,29.21 49.53,29.21 49.53,13.97 49.53,13.97 8.89,13.97 8.89,29.21 49.53,29.21
Holes 1 mm at 82.55,41.91 82.55,39.37 82.55,36.83 80.01,36.83 80.01,39.37 80.01,41.91 77.47,41.91 77.47,39.37 82.55,34.29 80.01,34.29 74.93,41.91 74.93,39.37 74.93,36.83 74.93,34.29 77.47,34.29 82.55,6.35 80.01,6.35 82.55,3.81 80.01,3.81 77.47,3.81 77.47,1.27 80.01,1.27 82.55,1.27 74.93,1.27 74.93,3.81 74.93,6.35 74.93,8.89 77.47,8.89 82.55,8.89 80.01,8.89 1.27,6.35 1.27,1.27 3.81,6.35 3.81,1.27 6.35,6.35 8.89,6.35 11.43,6.35 13.97,6.35 16.51,6.35 16.51,1.27 13.97,1.27 11.43,1.27 8.89,1.27 6.35,1.27 16.51,11.43 16.51,8.89 13.97,11.43 13.97,8.89 11.43,11.43 11.43,8.89 8.89,11.43 8.89,8.89 6.35,11.43 6.35,8.89 6.35,13.97 6.35,16.51 6.35,19.05 6.35,21.59 6.35,24.13 6.35,26.67 6.35,29.21 6.35,31.75 8.89,31.75 11.43,31.75 11.43,34.29 11.43,36.83 11.43,39.37 11.43,41.91 13.97,41.91 16.51,41.91 19.05,41.91 21.59,41.91 24.13,41.91 26.67,41.91 26.67,36.83 24.13,34.29 26.67,34.29 29.21,36.83 29.21,34.29 29.21,31.75 31.75,36.83 31.75,34.29 31.75,31.75 34.29,34.29 36.83,34.29 36.83,31.75 34.29,36.83 36.83,36.83 39.37,36.83 39.37,34.29 29.21,41.91 31.75,41.91 34.29,41.91 36.83,41.91 39.37,41.91 41.91,41.91 44.45,41.91 44.45,39.37 44.45,36.83 44.45,34.29 46.99,34.29 46.99,36.83 46.99,39.37 46.99,41.91 49.53,41.91 49.53,39.37 49.53,36.83 49.53,34.29 52.07,34.29 54.61,34.29 57.15,34.29 59.69,34.29 57.15,31.75 62.23,34.29 64.77,34.29 67.31,34.29 69.85,34.29 72.39,34.29 72.39,36.83 72.39,41.91 72.39,39.37 69.85,36.83 69.85,39.37 69.85,41.91 67.31,41.91 67.31,39.37 67.31,36.83 64.77,36.83 64.77,39.37 64.77,41.91 62.23,41.91 62.23,39.37 62.23,36.83 59.69,41.91 59.69,39.37 59.69,36.83 57.15,41.91 57.15,39.37 57.15,36.83 54.61,41.91 54.61,39.37 54.61,36.83 52.07,41.91 52.07,39.37 52.07,36.83 52.07,29.21 62.23,11.43 59.69,11.43 59.69,13.97 59.69,19.05 59.69,21.59 57.15,26.67 57.15,24.13 57.15,21.59 57.15,19.05 57.15,13.97 57.15,11.43 54.61,11.43 54.61,13.97 54.61,19.05 54.61,21.59 54.61,24.13 54.61,26.67 52.07,26.67 52.07,24.13 52.07,21.59 52.07,19.05 52.07,13.97 52.07,11.43 49.53,11.43 41.91,11.43 41.91,8.89 41.91,6.35 36.83,8.89 34.29,8.89 1.27,8.89 3.81,8.89 3.81,11.43 1.27,11.43 1.27,13.97 3.81,13.97 3.81,16.51 1.27,16.51 3.81,19.05 1.27,19.05 1.27,21.59 3.81,21.59 3.81,24.13 1.27,24.13 1.27,41.91 3.81,41.91 8.89,41.91 6.35,41.91 8.89,39.37 8.89,36.83 8.89,34.29 6.35,39.37 6.35,36.83 6.35,34.29 3.81,39.37 1.27,39.37 1.27,36.83 3.81,36.83 3.81,34.29 1.27,34.29 1.27,31.75 3.81,31.75 3.81,29.21 1.27,29.21 1.27,26.67 3.81,26.67 19.05,1.27 21.59,1.27 24.13,1.27 26.67,1.27 29.21,1.27 31.75,1.27 34.29,1.27 36.83,1.27 39.37,1.27 41.91,1.27 46.99,6.35 46.99,3.81 46.99,1.27 44.45,1.27 49.53,1.27 49.53,3.81 49.53,6.35 59.69,6.35 57.15,6.35 54.61,6.35 52.07,6.35 52.07,3.81 54.61,3.81 57.15,3.81 59.69,3.81 59.69,1.27 57.15,1.27 54.61,1.27 52.07,1.27 67.31,8.89 69.85,8.89 69.85,6.35 62.23,6.35 64.77,6.35 67.31,6.35 67.31,3.81 64.77,3.81 62.23,3.81 62.23,1.27 64.77,1.27 67.31,1.27 69.85,3.81 69.85,1.27 72.39,1.27 72.39,3.81 72.39,6.35 72.39,8.89 72.39,11.43 74.93,11.43 77.47,11.43 80.01,11.43 82.55,11.43 82.55,31.75 82.55,29.21 82.55,26.67 82.55,24.13 82.55,21.59 82.55,19.05 82.55,16.51 82.55,13.97 80.01,13.97 80.01,16.51 80.01,19.05 80.01,21.59 80.01,24.13 80.01,26.67 80.01,29.21 80.01,31.75 77.47,31.75 77.47,29.21 77.47,26.67 77.47,24.13 77.47,21.59 77.47,19.05 77.47,16.51 77.47,13.97 74.93,13.97 72.39,13.97 72.39,16.51 74.93,16.51 74.93,19.05 72.39,19.05 72.39,21.59 74.93,21.59 74.93,24.13 72.39,24.13 72.39,26.67 74.93,26.67 74.93,29.21 72.39,29.21 72.39,31.75 74.93,31.75 67.31,31.75 8.89,16.51 11.43,16.51 8.89,19.05 11.43,19.05 11.43,21.59 8.89,21.59 8.89,24.13 8.89,26.67 11.43,26.67 11.43,24.13 13.97,26.67 13.97,24.13 13.97,21.59 13.97,19.05 16.51,16.51 16.51,19.05 16.51,21.59 16.51,24.13 16.51,26.67 19.05,26.67 21.59,26.67 24.13,26.67 26.67,26.67 36.83,26.67 39.37,26.67 41.91,26.67 44.45,26.67 46.99,26.67 49.53,26.67 46.99,19.05 49.53,19.05 49.53,21.59 46.99,21.59 46.99,24.13 49.53,24.13 44.45,24.13 41.91,16.51 39.37,24.13 39.37,19.05 39.37,16.51 36.83,16.51 36.83,19.05 36.83,24.13 34.29,16.51 34.29,11.43 31.75,19.05 31.75,24.13 29.21,24.13 26.67,24.13 24.13,24.13 21.59,24.13 19.05,24.13 19.05,21.59 21.59,21.59 24.13,21.59 26.67,21.59 29.21,21.59 29.21,19.05 26.67,19.05 24.13,19.05 21.59,19.05 19.05,19.05 19.05,16.51 21.59,16.51 24.13,16.51 26.67,16.51 59.69,31.75 62.23,31.75 64.77,31.75 62.23,19.05 1.27,3.81 3.81,3.81 6.35,3.81 8.89,3.81 11.43,3.81 13.97,3.81 16.51,3.81 34.29,31.75 69.85,11.43 64.77,29.21 62.23,29.21 59.69,29.21 54.61,31.75 57.15,29.21 52.07,31.75 49.53,31.75 54.61,29.21 59.69,26.67 62.23,26.67 64.77,26.67 59.69,24.13 62.23,24.13 64.77,24.13 64.77,21.59 62.23,21.59 46.99,31.75 44.45,31.75 36.83,11.43 67.31,29.21 67.31,26.67 67.31,24.13 64.77,19.05 62.23,16.51 62.23,13.97 59.69,16.51 57.15,16.51 54.61,16.51 52.07,16.51 49.53,16.51 46.99,16.51 67.31,11.43
Holes 3 mm at 57.73,30.63 57.73,15.09 57.73,15.09 57.73,30.63 57.73,30.63 57.73,15.09 57.73,15.09 57.73,30.63 57.73,30.63 57.73,15.09 57.73,15.09 57.73,30.63

### Footprints (pad centres in the part's own frame; a part is rotated, then mirrored left to right if it is on the bottom)
1,6/0,8 = drill 0.813 pad 1.6 octagon: 1 0,0
ARDUINO_NANO = drill 0.8 square: 1 -20.32,-7.62 | drill 0.8: 2 -17.78,-7.62; 3 -15.24,-7.62; 4 -12.7,-7.62; 5 -10.16,-7.62; 6 -7.62,-7.62; 7 -5.08,-7.62; 8 -2.54,-7.62; 9 0,-7.62; 10 2.54,-7.62; 11 5.08,-7.62; 12 7.62,-7.62; 13 10.16,-7.62; 14 12.7,-7.62; 15 15.24,-7.62; 16 15.24,7.62; 17 12.7,7.62; 18 10.16,7.62; 19 7.62,7.62; 20 5.08,7.62; 21 2.54,7.62; 22 0,7.62; 23 -2.54,7.62; 24 -5.08,7.62; 25 -7.62,7.62; 26 -10.16,7.62; 27 -12.7,7.62; 28 -15.24,7.62; 29 -17.78,7.62; 30 -20.32,7.62 | hole 1.778: -22.86,-7.62; -22.86,7.62; 17.78,7.62; 17.78,-7.62
1X03 = drill 1.016 pad 1.88: 1 0,0; 2 2.54,0; 3 5.08,0
AL60P = drill 1.016 pad 2.54 octagon: 1 -3.759,0; 2 3.759,0
GY-521 = drill 0.8 pad 1.778: ADO -10,-7.5; GND -10,5; INT -10,-10; SCL -10,2.5; SDA -10,0; VCC -10,7.5; XCL -10,-5; XDA -10,-2.5 | hole 3: 1.96,6.504; 1.957,-9.037

### Placement (x,y rotation side)
+3V3-1  67.31,13.97 0 bottom
+3V3-2  13.97,16.51 0 bottom
ARDUINO_NANO  31.75,21.59 0 top
CH5  31.75,26.67 0 top
CH5-2  29.21,11.43 0 top
CH6  29.21,26.67 0 top
CH6-2  31.75,11.43 0 top
ECS1(CCW)  13.97,39.37 270 top
ESC2(CW)  16.51,39.37 270 top
ESC3(CCW)  19.05,39.37 270 top
ESC4(CW)  21.59,39.37 270 top
PIEZO  38.1,21.59 180 top
RC1  19.05,3.81 90 top
RC2  21.59,3.81 90 top
RC3  24.13,3.81 90 top
RC4  26.67,3.81 90 top
RC5  29.21,3.81 90 top
RC6  31.75,3.81 90 top
SCL  67.31,19.05 0 bottom
SCL-2  31.75,16.51 0 bottom
SDA  67.31,21.59 0 bottom
SDA-2  29.21,16.51 0 bottom
U1  59.69,21.59 180 top
VCC-1  24.13,36.83 0 bottom
VCC-2  46.99,11.43 0 bottom

### Tracks (layer width: path | path; a pad name or v marks a point on that pad's centre or on a via)
+3V3  (1 unrouted)
  Bottom 0.813: +3V3-2.1 ARDUINO_NANO.2 | U1.VCC 69.57,13.97 +3V3-1.1
+5V
  Bottom 0.813: RC1.2 RC2.2 RC3.2 RC4.2 RC5.2 RC6.2 39.37,6.35 ARDUINO_NANO.12
CH1
  Bottom 0.813: ARDUINO_NANO.4 RC1.3
CH2
  Bottom 0.813: ARDUINO_NANO.5 RC2.3
CH3
  Bottom 0.813: ARDUINO_NANO.6 RC3.3
CH4
  Bottom 0.813: ARDUINO_NANO.7 RC4.3
CH5  (1 unrouted)
  Bottom 0.813: RC5.3 CH5-2.1 | ARDUINO_NANO.22 CH5.1
CH6  (1 unrouted)
  Bottom 0.813: CH6.1 ARDUINO_NANO.23 | RC6.3 CH6-2.1
ESC1
  Bottom 0.813: ECS1(CCW).3 ARDUINO_NANO.29
ESC2
  Bottom 0.813: ESC2(CW).3 ARDUINO_NANO.28
ESC3
  Bottom 0.813: ESC3(CCW).3 ARDUINO_NANO.27
ESC4
  Bottom 0.813: ESC4(CW).3 21.59,31.75 26.67,31.75 ARDUINO_NANO.24
GND  (1 unrouted)
  Bottom 0.813: RC1.1 RC2.1 RC3.1 RC4.1 RC5.1 RC6.1 44.45,3.81 44.45,8.89 | 44.45,8.89 ARDUINO_NANO.14 44.45,21.59 PIEZO.1 | ECS1(CCW).1 ESC2(CW).1 ESC3(CCW).1 ESC4(CW).1 41.91,39.37 41.91,31.75 39.37,31.75 ARDUINO_NANO.19 | U1.GND 69.61,16.51 64.77,16.51 64.77,8.89 44.45,8.89
PIEZO
  Bottom 0.813: PIEZO.2 34.29,21.64 ARDUINO_NANO.21
SCL  (1 unrouted)
  Bottom 0.813: U1.SCL 69.65,19.05 SCL.1 | SCL-2.1 ARDUINO_NANO.9
SDA  (2 unrouted)
  Bottom 0.813: 69.69,21.36 69.63,21.59 SDA.1 | SDA-2.1 ARDUINO_NANO.8
VCC  (1 unrouted)
  Bottom 0.813: ECS1(CCW).2 ESC2(CW).2 ESC3(CCW).2 ESC4(CW).2 VCC-1.1 | ARDUINO_NANO.15 VCC-2.1